# EAGLE schematic Main (EAGLE 9.3.1)
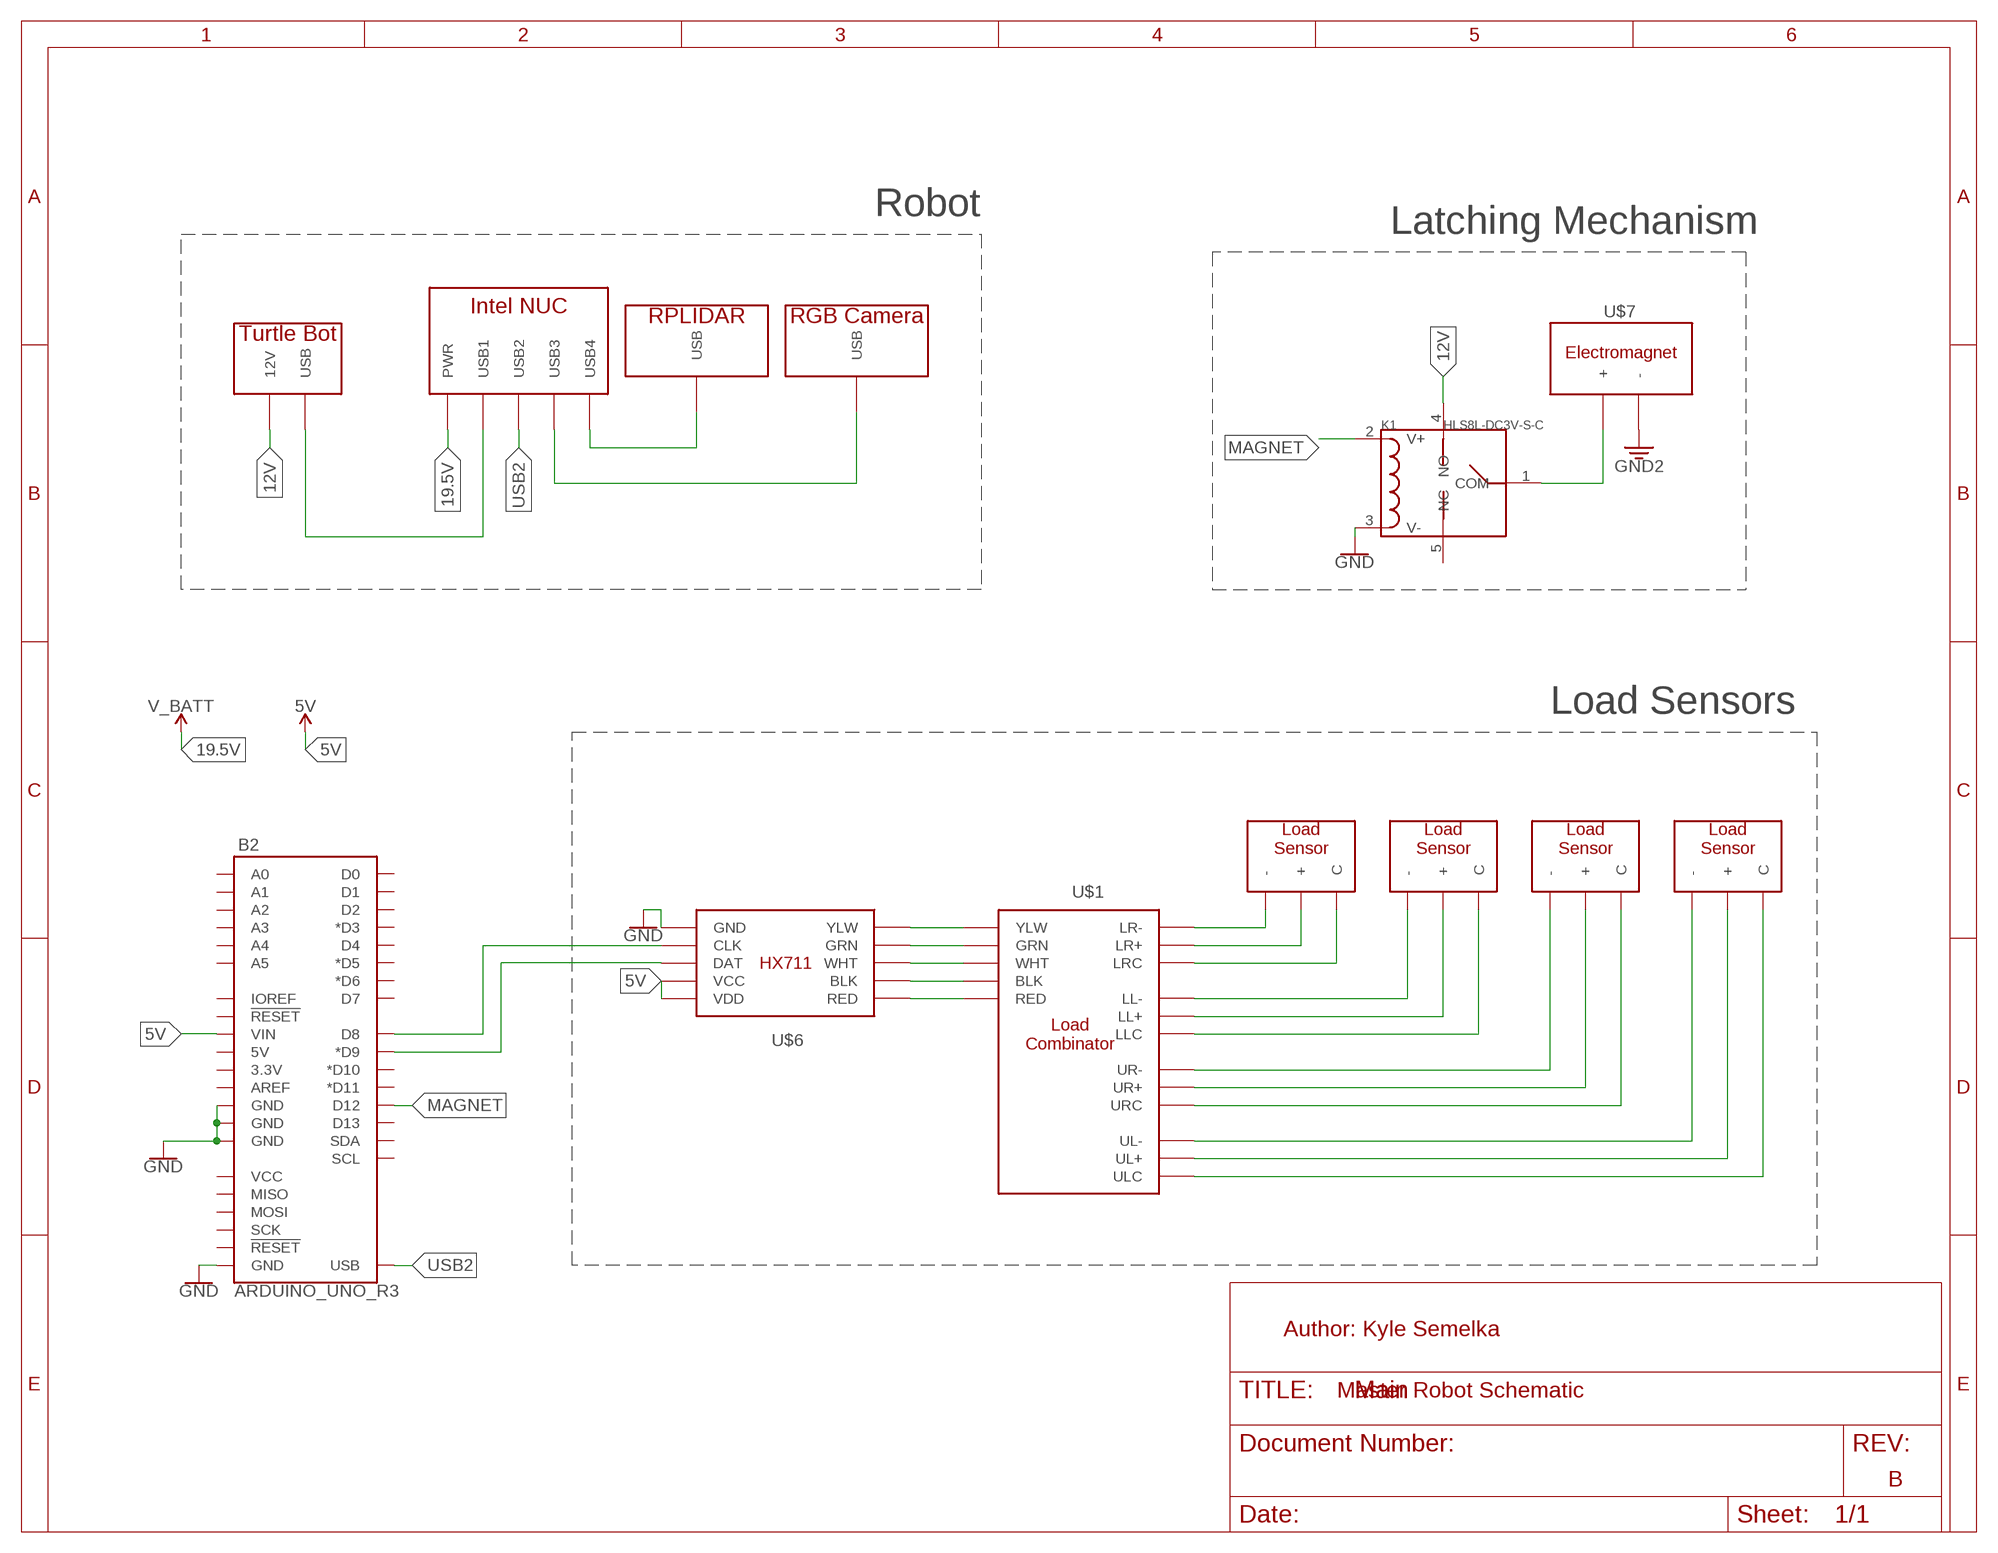
[diagram p0: schematic, sheet 1]

## Parts
B2  ARDUINO_UNO_R3  [ARDUINO_R3]
K1  HLS8L-DC3V-S-C  RELAY-HLS8L-DC3V-S-C(5P-19X15MM)  [REY5-19.0X15.0X15.0MM]
U$1  SPARKFUN-LOAD-COMBINATOR  (no package)
U$2  SPARKFUN-LOAD-SENSOR  (no package)
U$3  SPARKFUN-LOAD-SENSOR  (no package)
U$4  SPARKFUN-LOAD-SENSOR  (no package)
U$5  SPARKFUN-LOAD-SENSOR  (no package)
U$6  HX711  (no package)
U$7  ELECTROMAGNET  (no package)
U$8  TURTLEBOT  (no package)
U$9  INTEL_NUC  (no package)
U$10  CAMERA  (no package)
U$11  RPLIDAR  (no package)

## Nets
3.3V: U$7.- ; supply symbol labelled GND2
5V: B2.VIN U$6.VCC U$6.VDD
12V: K1.4(NO) U$8.12V
19.5V: U$9.PWR ; supply symbol labelled V_BATT
GND: B2.GND@1(GND) B2.GND@2(GND) B2.GND@3(GND) B2.GND@4(GND) K1.3(V-) U$6.GND
MAGNET: B2.D12 K1.2(V+)
N$1: U$9.USB4 U$11.USB
N$2: U$1.LR- U$2.-
N$3: U$1.LR+ U$2.+
N$4: U$1.LRC U$2.C
N$5: U$1.LL- U$3.-
N$6: U$1.LL+ U$3.+
N$7: U$1.LLC U$3.C
N$8: U$1.UR- U$4.-
N$9: U$1.UR+ U$4.+
N$10: U$1.URC U$4.C
N$11: U$1.UL- U$5.-
N$12: U$1.UL+ U$5.+
N$13: U$1.ULC U$5.C
N$14: U$1.YLW U$6.YLW
N$15: U$1.GRN U$6.GRN
N$16: U$1.WHT U$6.WHT
N$17: U$1.BLK U$6.BLK
N$18: U$1.RED U$6.RED
N$20: B2.D8 U$6.CLK
N$21: B2.D9(*D9) U$6.DAT
N$22: K1.1(COM) U$7.+
N$23: U$8.USB U$9.USB1
N$24: U$9.USB3 U$10.USB
USB2: B2.USB U$9.USB2
Unconnected: B2.3.3V B2.5V B2.A0 B2.A1 B2.A2 B2.A3 B2.A4 B2.A5 B2.AREF B2.D0 B2.D1 B2.D2 B2.D3(*D3) B2.D4 B2.D5(*D5) B2.D6(*D6) B2.D7 B2.D10(*D10) B2.D11(*D11) B2.D13 B2.IOREF B2.MISO B2.MOSI B2.RESET@1(!RESET!) B2.RESET@2(!RESET!) B2.SCK B2.SCL B2.SDA B2.VCC K1.5(NC)

## Notes on the sheet
- Robot
- Latching Mechanism
- Load Sensors
- Author: Kyle Semelka
- Master Robot Schematic
- B

## Library data of the parts
B2 = SparkFun-Boards-Altered:ARDUINO_UNO_R3: Arduino R3 Footprint with SPI header Arduino Uno R3 Compatible Footprint. Matches PCB size of the original board. SparkFun Products: SAMD21 Dev Breakout <https://www.sparkfun.com/products/13672> RedBoard <https://www.sparkfun.com/products/12757> R3 Stackable Headers <https://www.sparkfun.com/products/11417>
K1 = Seeed-Relay:RELAY-HLS8L-DC3V-S-C(5P-19X15MM): 315030009; MPN: HLS8L-DC3V-S-C
U$1 = Sparkfun-Load Sensors:SPARKFUN-LOAD-COMBINATOR
U$2-U$5 = Sparkfun-Load Sensors:SPARKFUN-LOAD-SENSOR
U$6 = Sparkfun-Load Sensors:HX711
U$7 = Sparkfun-Load Sensors:ELECTROMAGNET
U$8 = SeniorDesignParts:TURTLEBOT
U$9 = SeniorDesignParts:INTEL_NUC
U$10 = SeniorDesignParts:CAMERA
U$11 = SeniorDesignParts:RPLIDAR